# EasyEDA Pro project triple-J UAV 原理图+PCB.epro, schematic 飞控板_1

## Sheets
1 MCU: Assembly Variant: Basic; Board Name: Board1; Create Date: 2026-07-12; Page Name: P1; Project Name: stm32无人机; Schematic Name: Schematic1; Update Date: 2026-07-12; Company: 嘉立创EDA; Page Size: A4; Version: V1.0
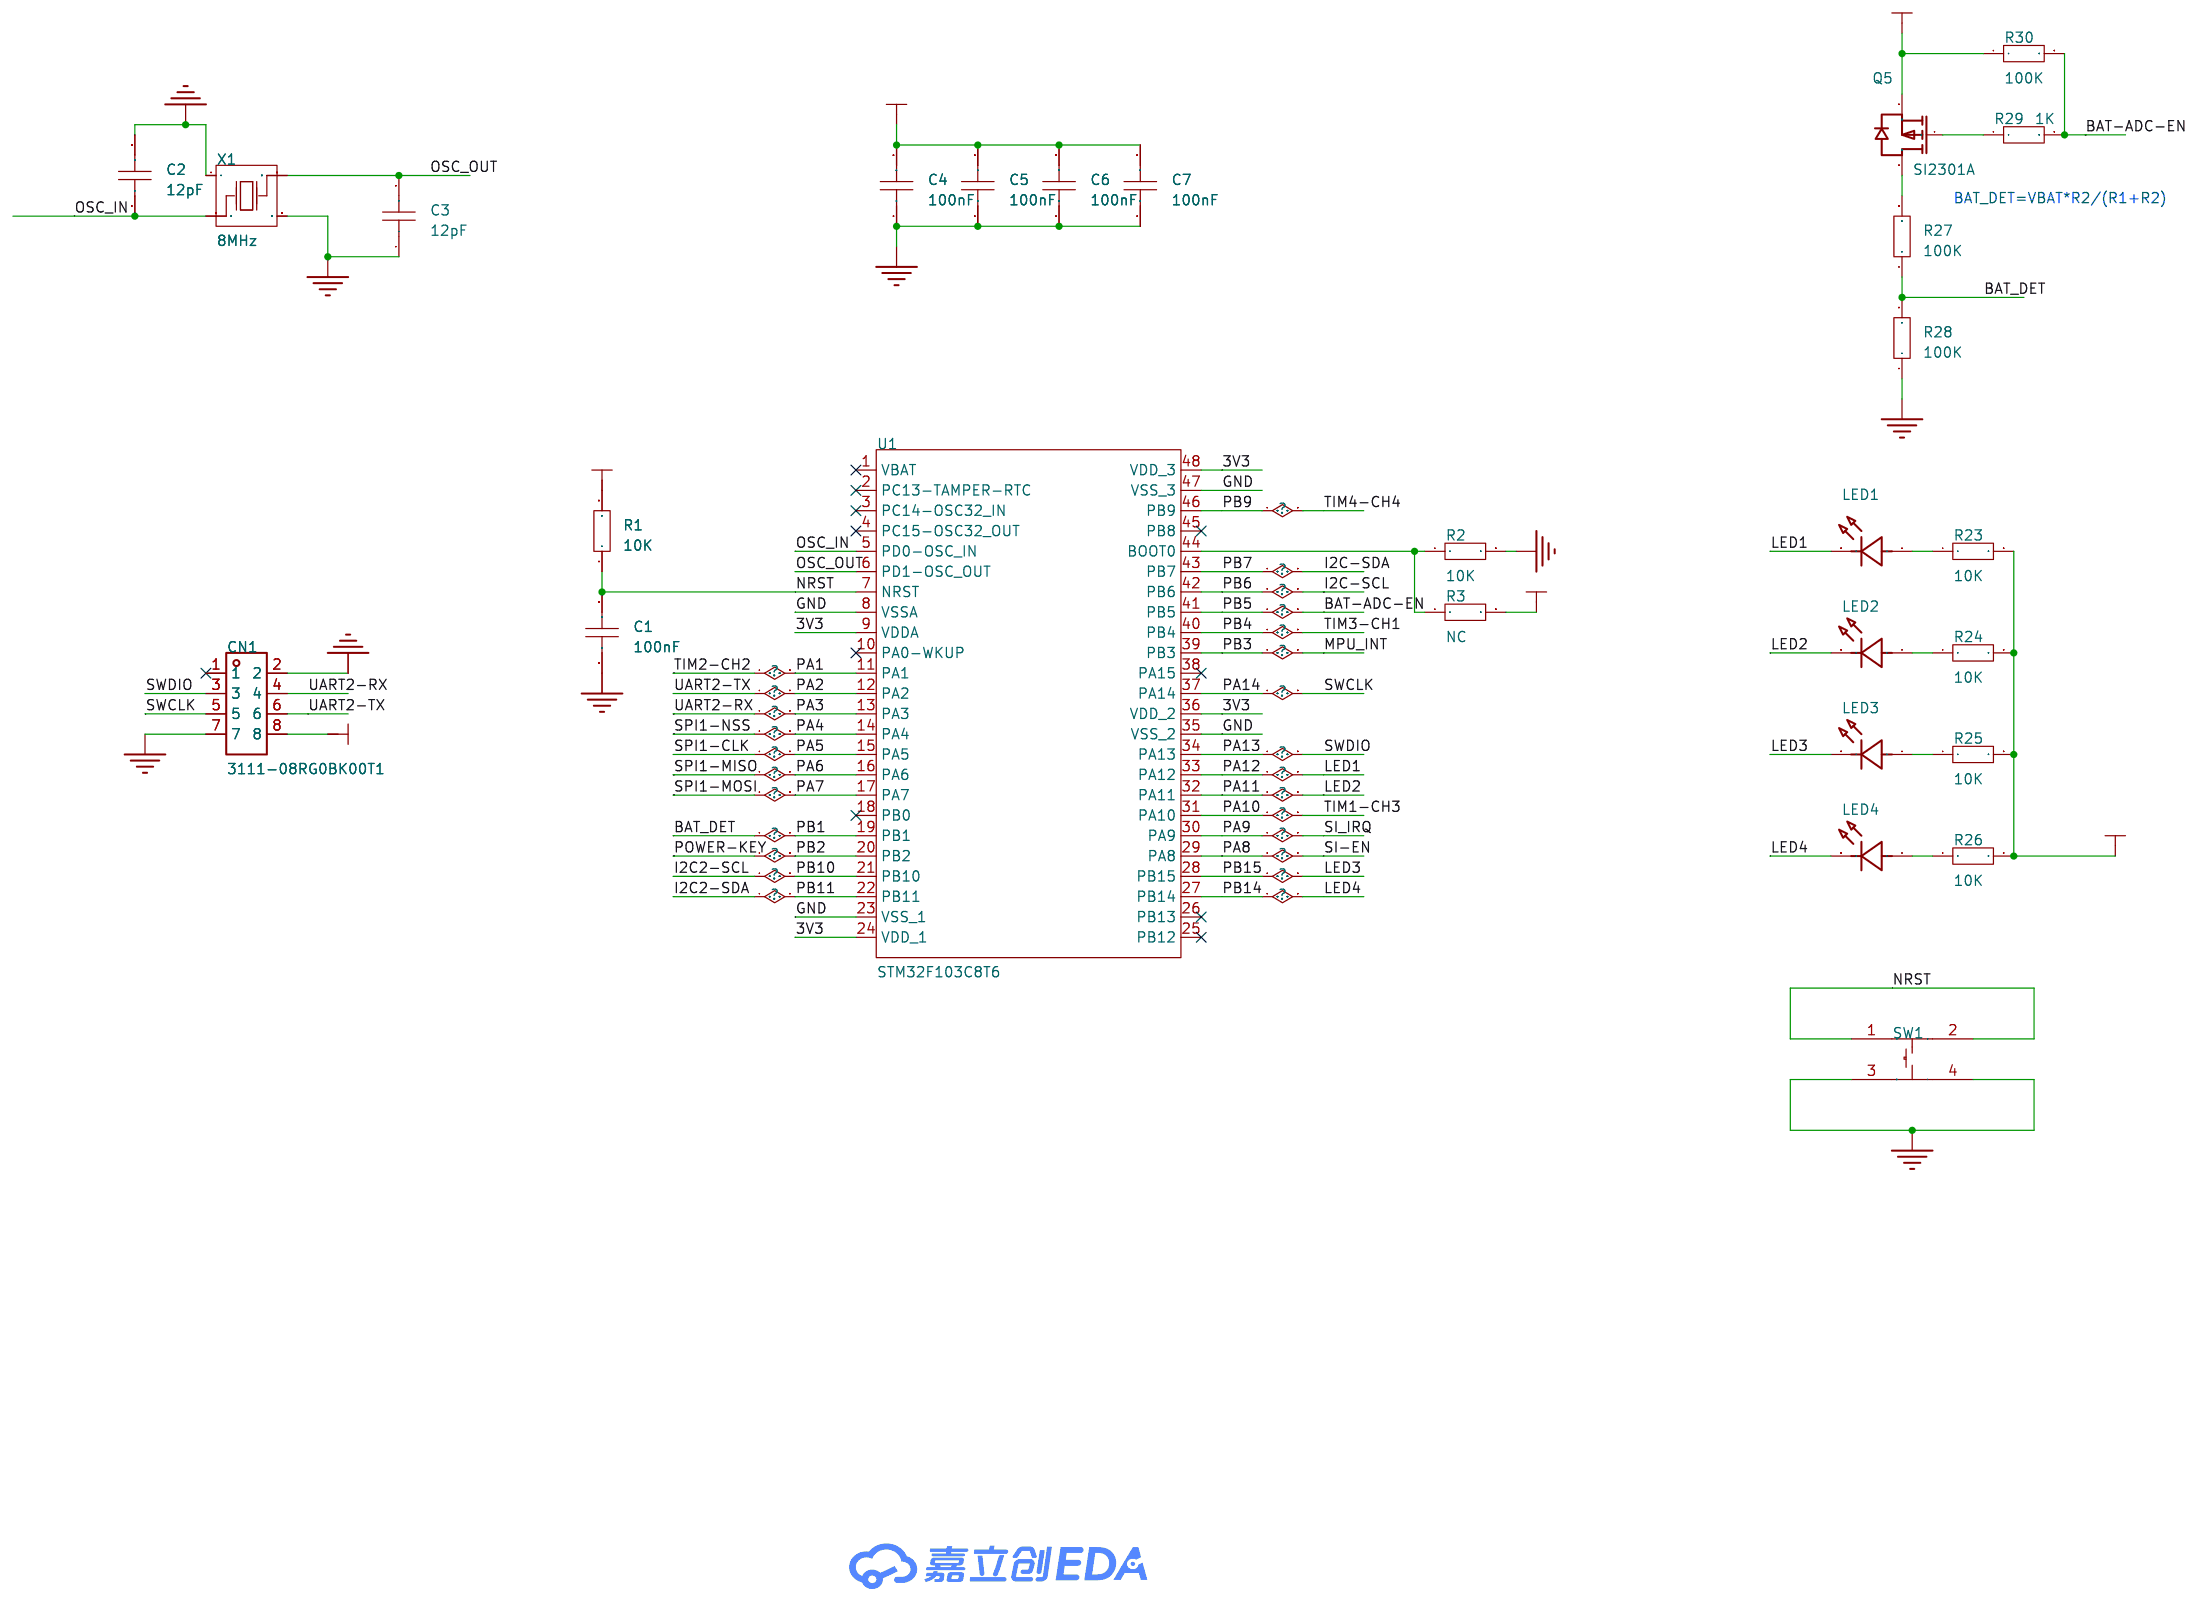
[diagram p5: MCU]
2 MPU
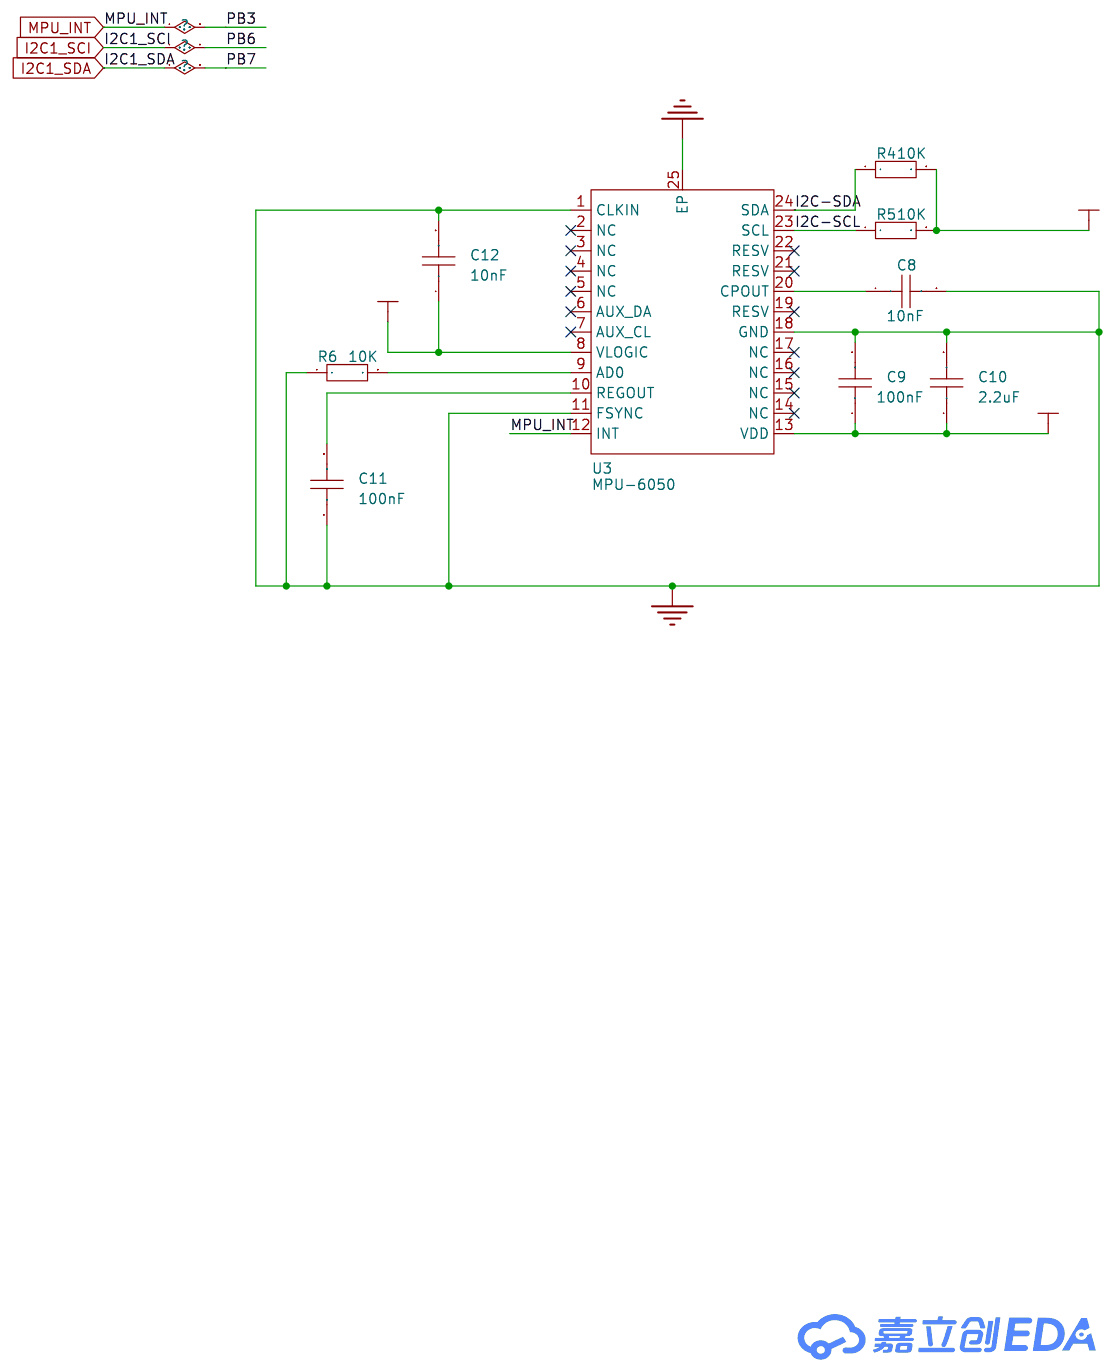
[diagram p6: MPU]
3 SI24R1
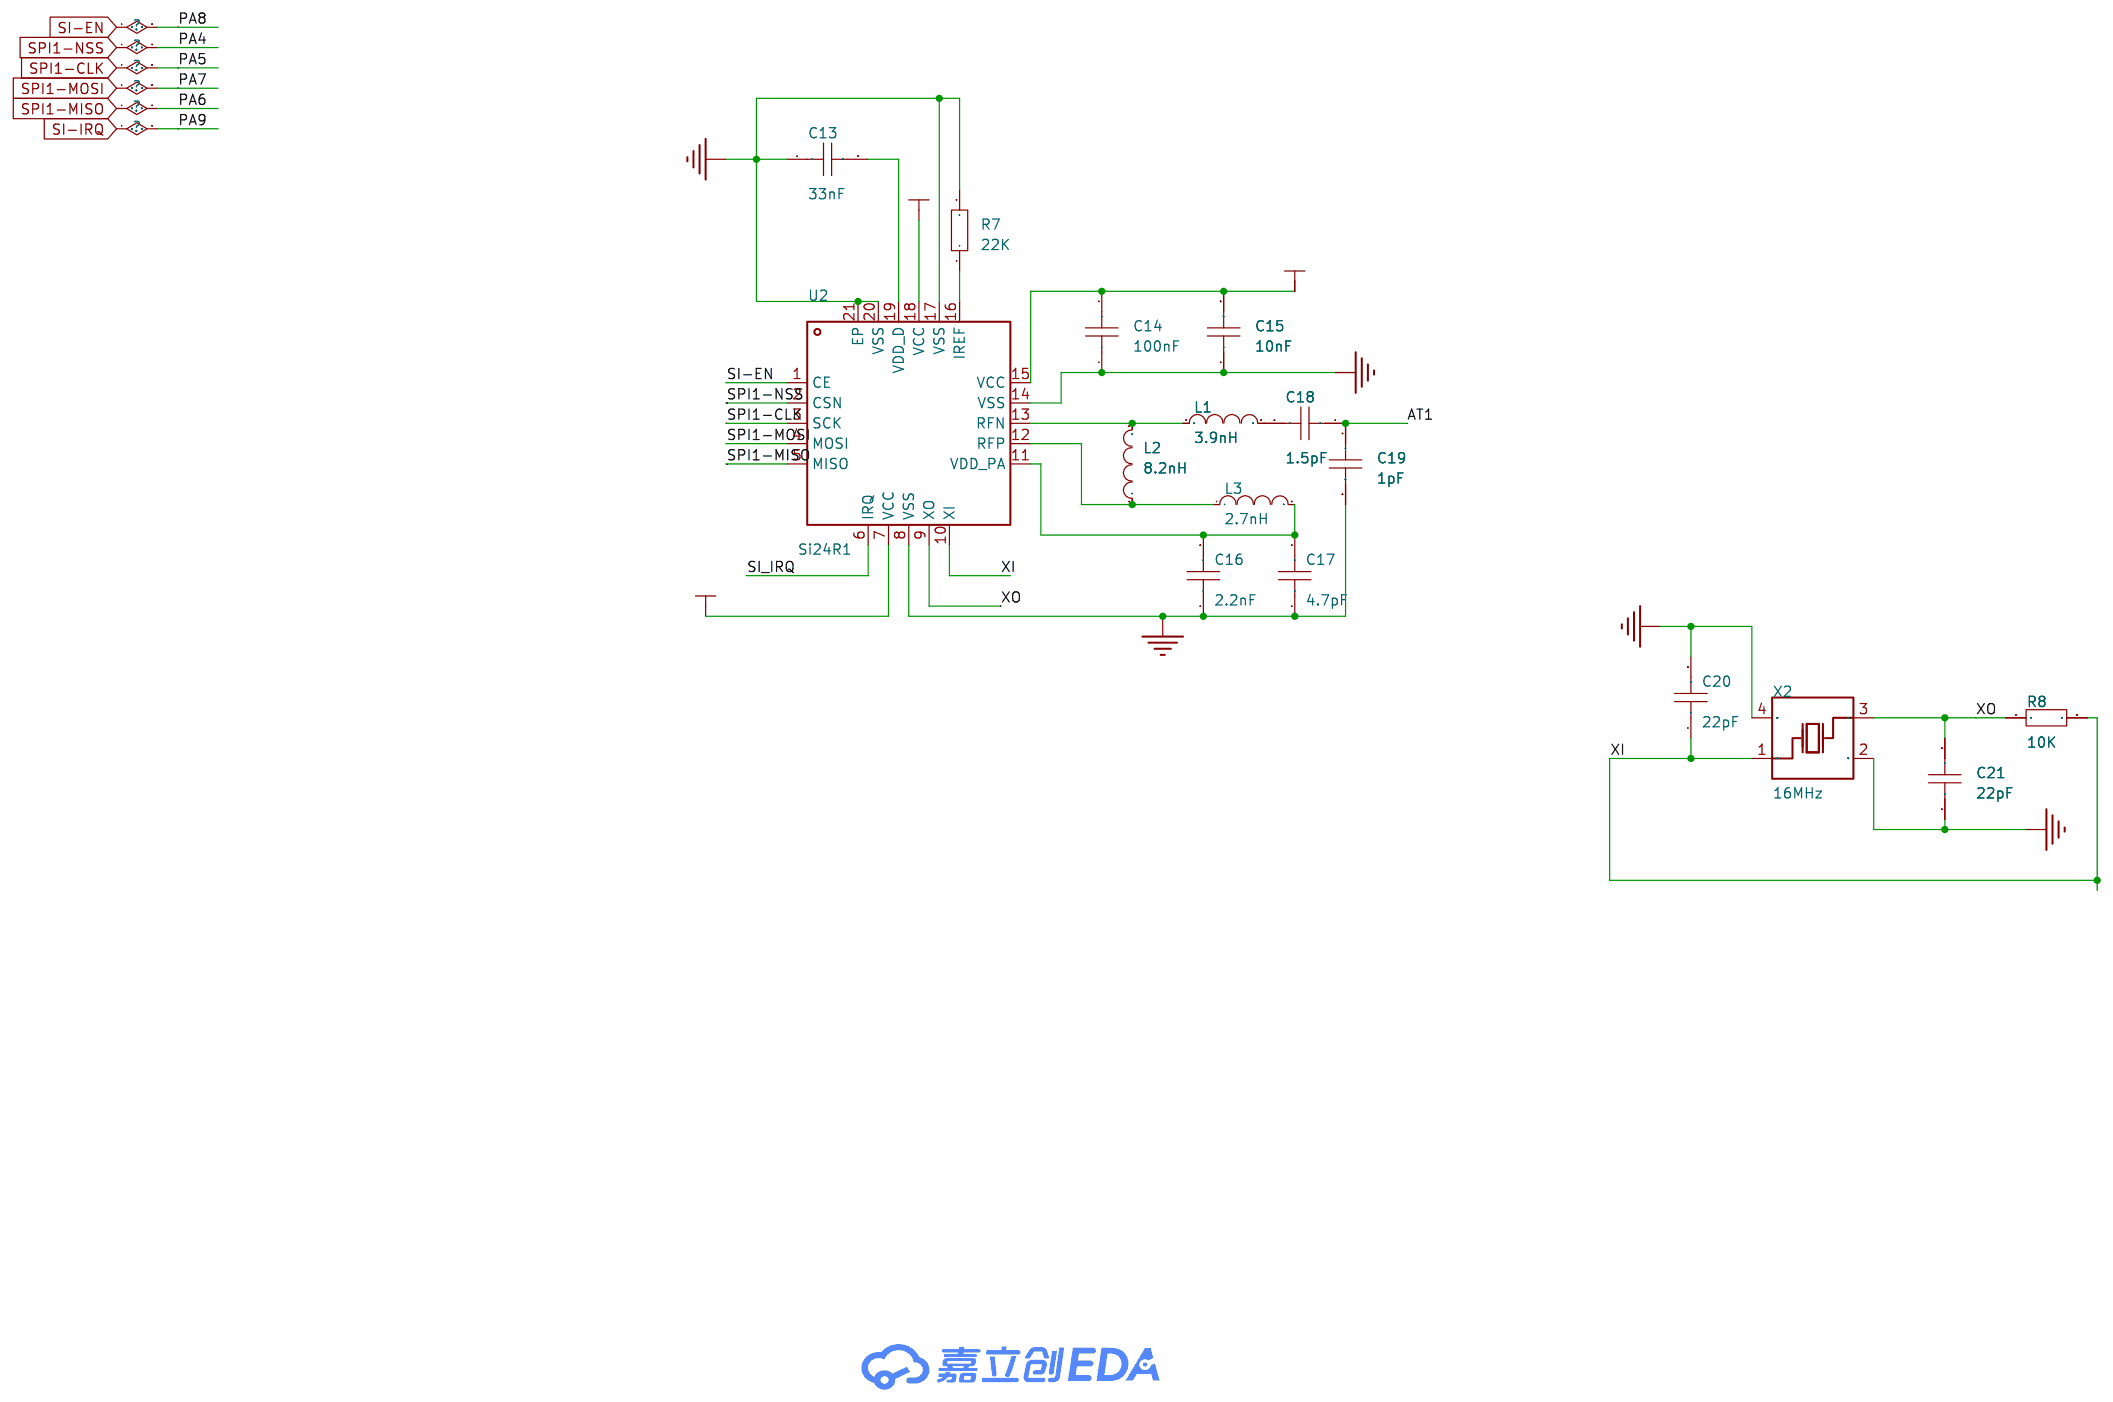
[diagram p7: SI24R1]
4 激光测高VL53
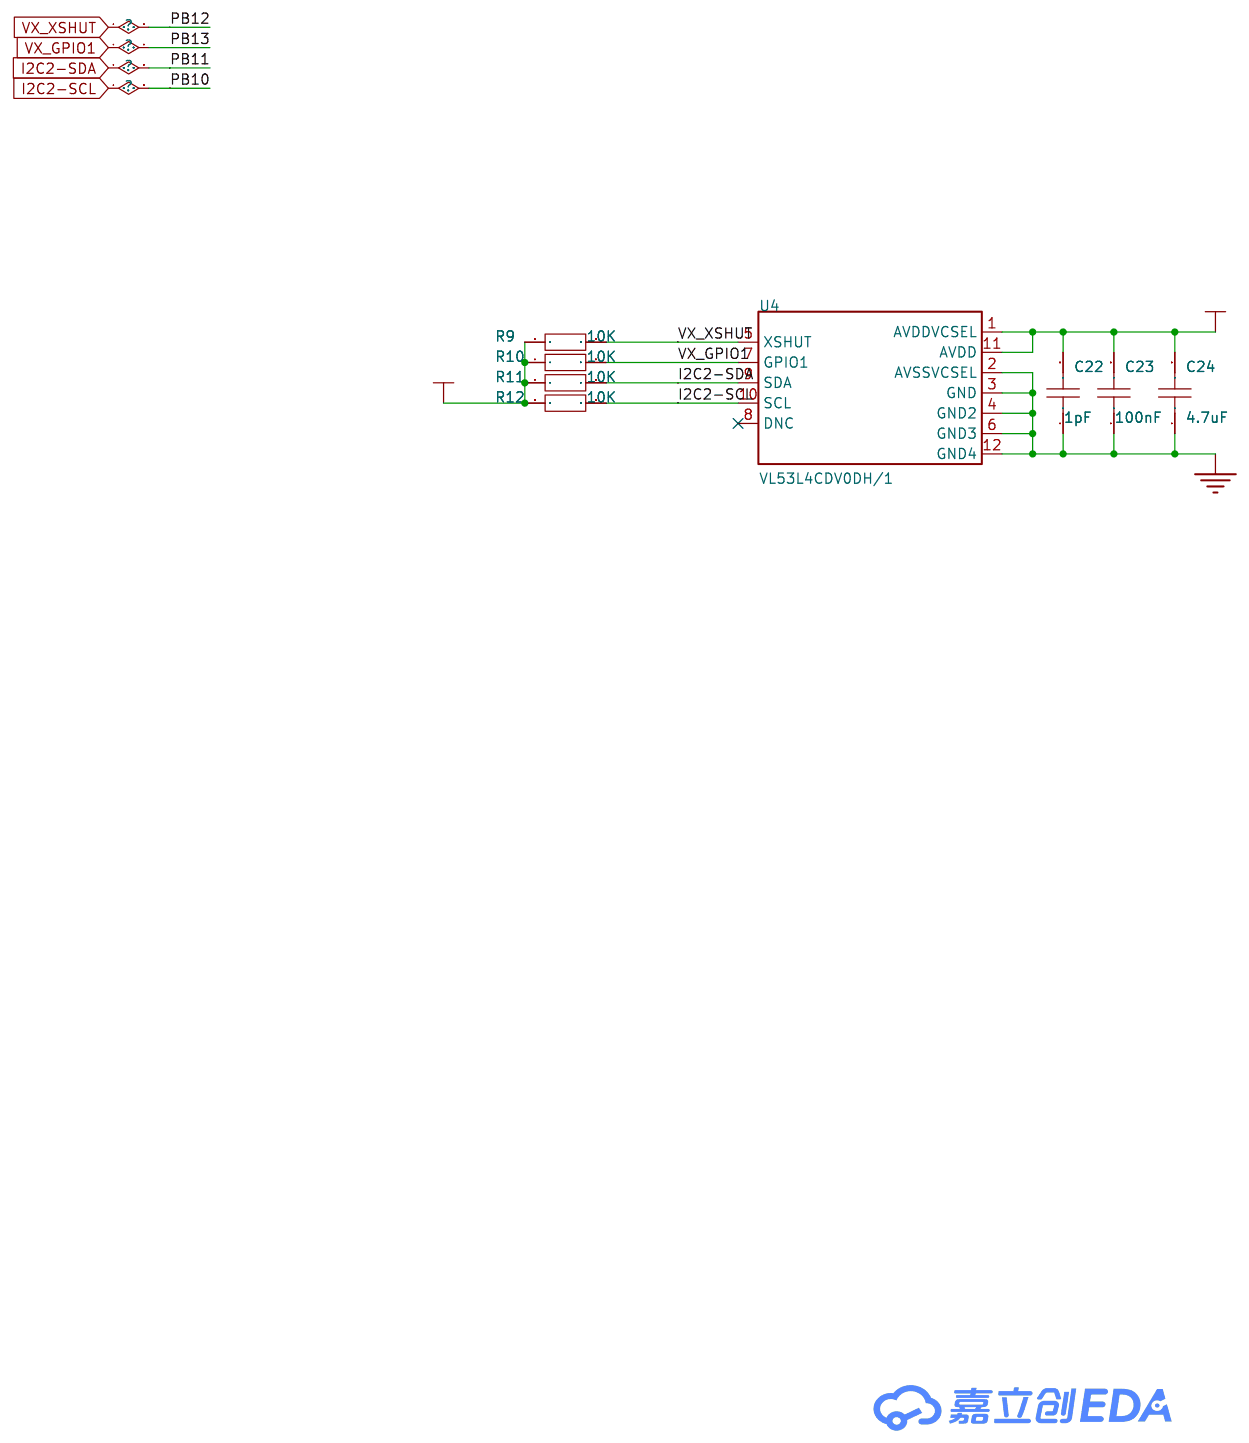
[diagram p8: 激光测高VL53]
5 电源管理
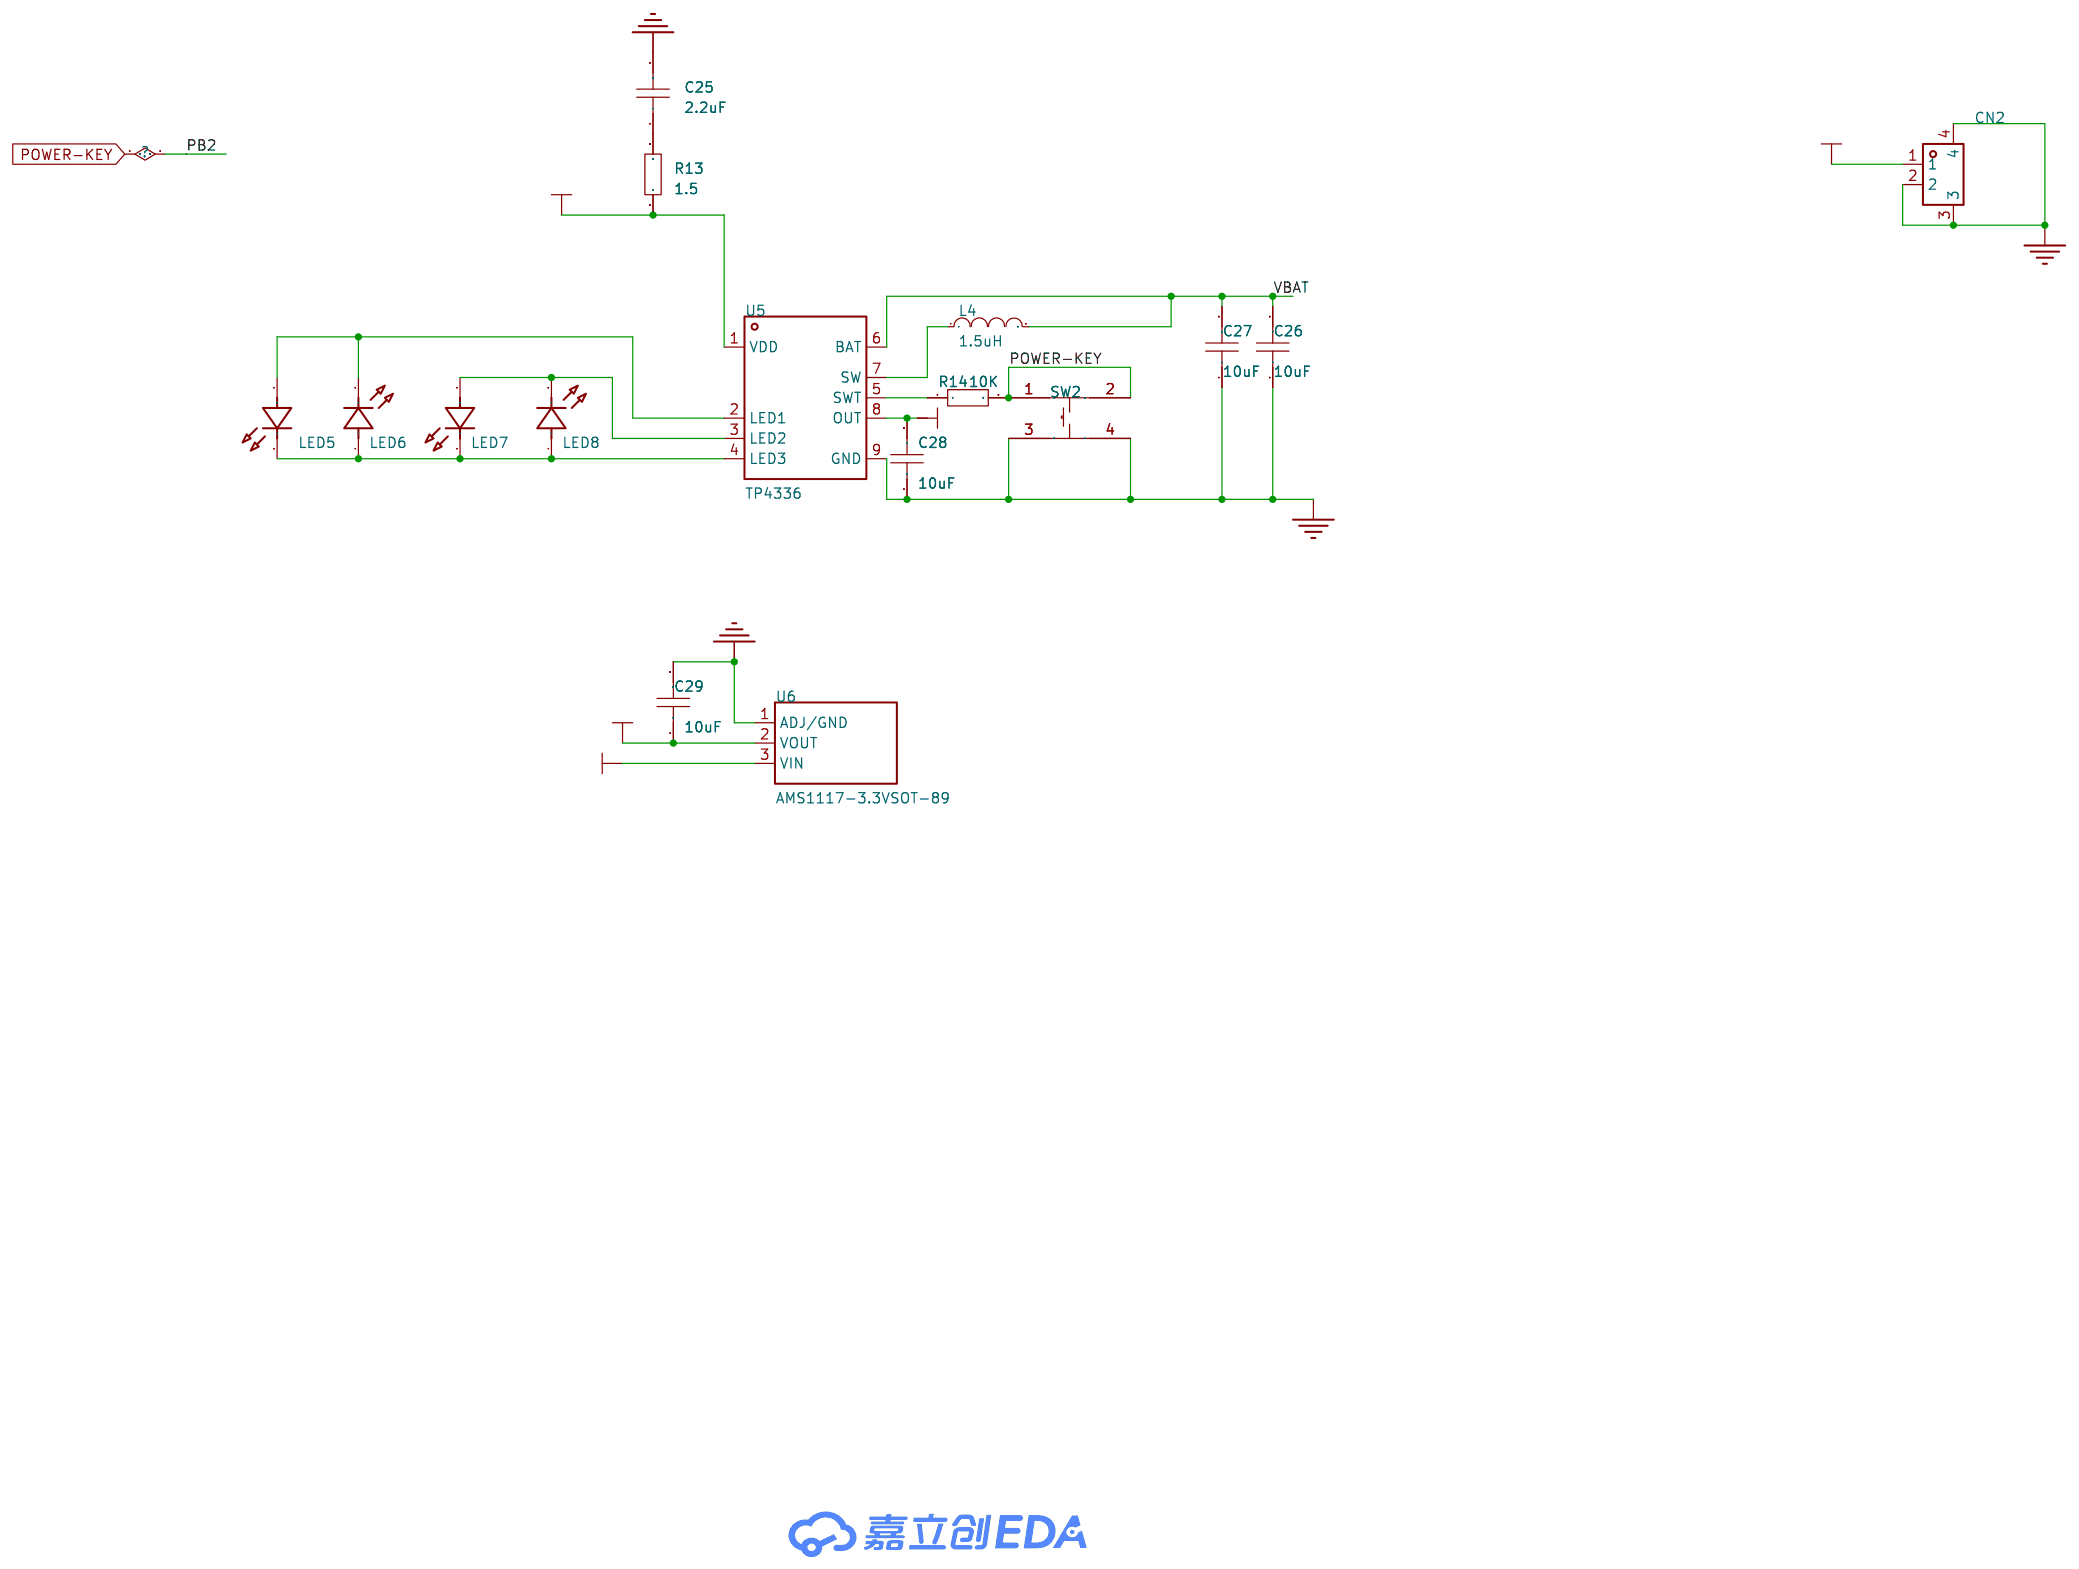
[diagram p9: 电源管理]
6 电机驱动
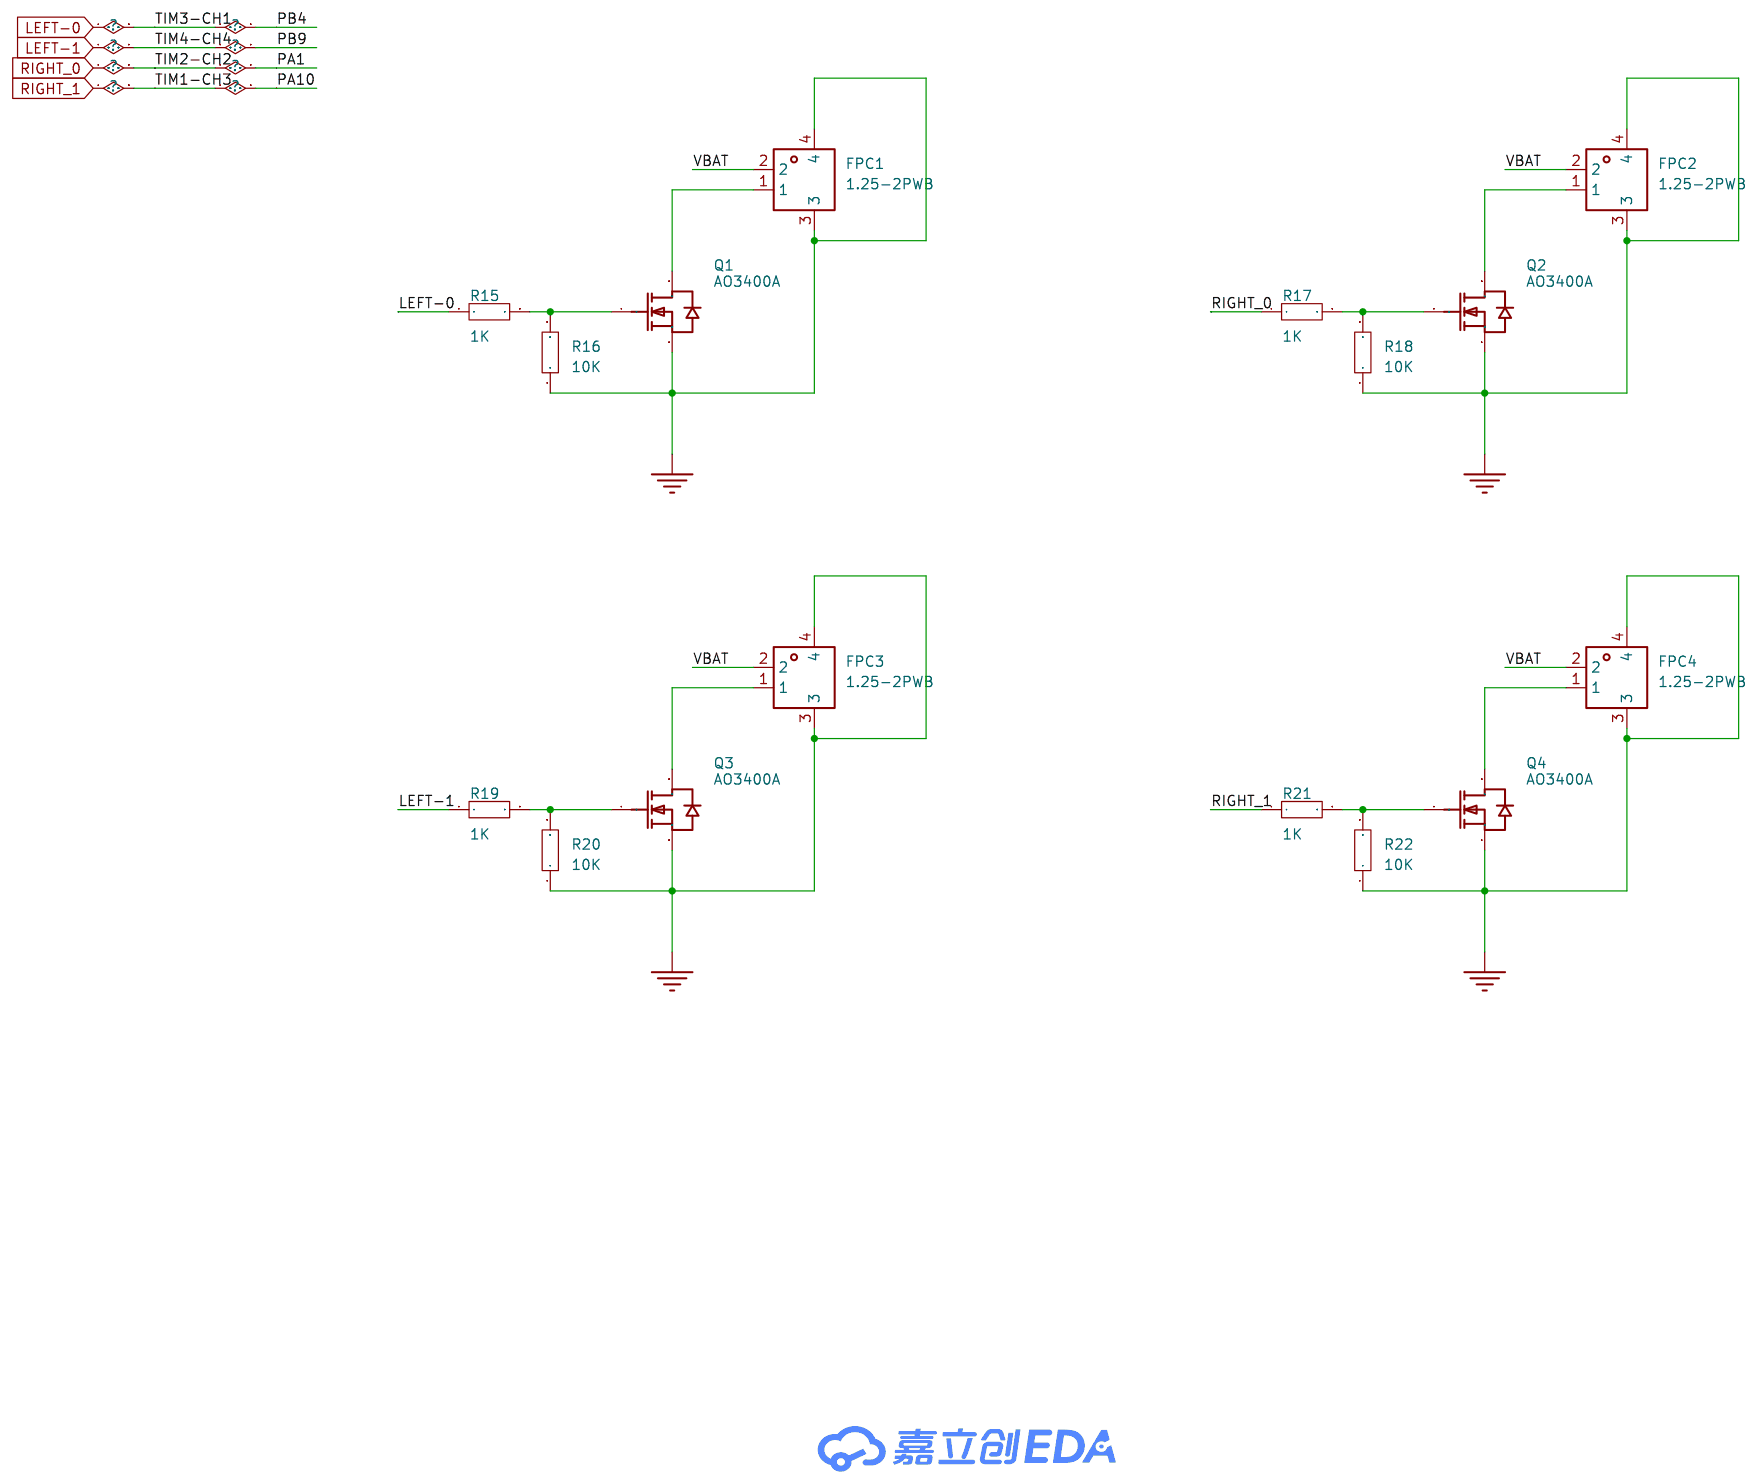
[diagram p10: 电机驱动]

## Parts
sheet MCU
C1  100nF  [C0603]
C2  12pF  [C0603]
C3  12pF  [C0603]
C4  100nF  [C0603]
C5  100nF  [C0603]
C6  100nF  [C0603]
C7  100nF  [C0603]
CN1  3111-08RG0BK00T1  [CONN-TH_3111-08RG0BK00T1]
LED1  XL-1005UYC  [LED0402-FD_YELLOW]
LED2  XL-1005UYC  [LED0402-FD_YELLOW]
LED3  XL-1005UYC  [LED0402-FD_YELLOW]
LED4  XL-1005UYC  [LED0402-FD_YELLOW]
Q5  SI2301A  [SOT-23-3_L2.9-W1.3-P1.90-LS2.4-BR]
R1  10K  [R0603]
R2  10K  [R0603]
R3  NC  [R0603]
R23  10K  [R0603]
R24  10K  [R0603]
R25  10K  [R0603]
R26  10K  [R0603]
R27  100K  [R0603]
R28  100K  [R0603]
R29  1K  [R0603]
R30  100K  [R0603]
SW1  SKRPACE010  [KEY-SMD_4P-L4.2-W3.2-P2.20-LS4.6]
U1  STM32F103C8T6  [LQFP-48_L7.0-W7.0-P0.50-LS9.0-BL]
X1  8MHz  [CRYSTAL-SMD_4P-L3.2-W2.5-BL]
sheet MPU
C8  10nF  [C0603]
C9  100nF  [C0603]
C10  2.2uF  [C0603]
C11  100nF  [C0603]
C12  10nF  [C0603]
R4  10K  [R0603]
R5  10K  [R0603]
R6  10K  [R0603]
U3  MPU-6050  [QFN-24_L4.0-W4.0-P0.50-BL-EP2.7]
sheet SI24R1
C13  33nF  [C0603]
C14  100nF  [C0603]
C15  10nF  [C0603]
C16  2.2nF  [C0603]
C17  4.7pF  [C0603]
C18  1.5pF  [C0603]
C19  1pF  [C0603]
C20  22pF  [C0603]
C21  22pF  [C0603]
L1  3.9nH  [L0603]
L2  8.2nH  [L0603]
L3  2.7nH  [L0603]
R7  22K  [R0603]
R8  10K  [R0603]
U2  Si24R1  [QFN-20_L4.0-W4.0-P0.50-BL-EP]
X2  16MHz  [CRYSTAL-SMD_4P-L2.5-W2.0-BL-2]
sheet 激光测高VL53
C22  1pF  [C0603]
C23  100nF  [C0603]
C24  4.7uF  [C0603]
R9  10K  [R0603]
R10  10K  [R0603]
R11  10K  [R0603]
R12  10K  [R0603]
U4  VL53L4CDV0DH/1  [LGA-12_L4.4-W2.4_VL53L0X]
sheet 电机驱动
FPC1  1.25-2PWB  [CONN-SMD_2P-P1.25_DEALON_1.25-2PWB]
FPC2  1.25-2PWB  [CONN-SMD_2P-P1.25_DEALON_1.25-2PWB]
FPC3  1.25-2PWB  [CONN-SMD_2P-P1.25_DEALON_1.25-2PWB]
FPC4  1.25-2PWB  [CONN-SMD_2P-P1.25_DEALON_1.25-2PWB]
Q1  AO3400A  [SOT-23-3_L2.9-W1.3-P1.90-LS2.4-BR]
Q2  AO3400A  [SOT-23-3_L2.9-W1.3-P1.90-LS2.4-BR]
Q3  AO3400A  [SOT-23-3_L2.9-W1.3-P1.90-LS2.4-BR]
Q4  AO3400A  [SOT-23-3_L2.9-W1.3-P1.90-LS2.4-BR]
R15  1K  [R0603]
R16  10K  [R0603]
R17  1K  [R0603]
R18  10K  [R0603]
R19  1K  [R0603]
R20  10K  [R0603]
R21  1K  [R0603]
R22  10K  [R0603]
sheet 电源管理
C25  2.2uF  [C0603]
C26  10uF  [C0603]
C27  10uF  [C0603]
C28  10uF  [C0603]
C29  10uF  [C0603]
CN2  ZX-XH2.54-2PWT  [CONN-SMD_2P-P2.54_MEGASTAR_ZX-XH2.54-2PWT]
L4  1.5uH  [L0603]
LED5  XL-1005UYC  [LED0402-FD_YELLOW]
LED6  XL-1005UYC  [LED0402-FD_YELLOW]
LED7  XL-1005UYC  [LED0402-FD_YELLOW]
LED8  XL-1005UYC  [LED0402-FD_YELLOW]
R13  1.5  [R0603]
R14  10K  [R0603]
SW2  SKRPACE010  [KEY-SMD_4P-L4.2-W3.2-P2.20-LS4.6]
U5  TP4336  [ESOP-8_L4.9-W3.9-P1.27-LS6.0-BL-EP-1]
U6  AMS1117-3.3VSOT-89  [SOT-89-3_L4.5-W2.5-P1.50-LS4.2-BR]

## Library data of the parts
C1-C29 = CAP_0603: Supplier Footprint: 0603
CN1 = 3111-08RG0BK00T1: LCSC Part Name: 2mm 2x4P 排数:2 每排P数:4; Supplier Part: C720751; Manufacturer: Wcon(维峰电子); Supplier Footprint: 弯插,P=2mm; JLCPCB Part Class: Extended Part; Datasheet: https://atta.szlcsc.com/upload/public/pdf/source/20200908/C720751_429ECEF3D5B5C4289EC4F86089830CA0.pdf; Supplier: LCSC; Connector Type: 简牛座; Pitch: 2mm; Structure: 2x4P; Holder Type: 弯插; Row Spacing: 2mm; Number of Rows: 2; Pin Number in each Row: 4; Contact Material: 黄铜; Contact Plating: 金
LED1-LED4 = XL-1005UYC: LCSC Part Name: 停产 0402黄光贴片式发光二极管; Supplier Part: C965792; Manufacturer: XINGLIGHT(成兴光); Supplier Footprint: 0402; JLCPCB Part Class: Extended Part; Datasheet: https://item.szlcsc.com/datasheet/XL-1005UYC/1051401.html; Supplier: LCSC; Illumination Color: 黄色; Voltage - Forward(Vf): 2.3V; Power(Watts): 50mW; Forward Current: 20mA; Wavelength - Dominant: 585nm~595nm; Peak Wavelength: 590nm; Diode Configuration: 独立二极管; Lens Color: 无色透明透镜; Luminous Intensity: 830mcd; Viewing Angle: 120°; Mounting Style: 正贴; Operating Temperature: -20℃~+85℃
Q5 = SI2301A: LCSC Part Name: 1个P沟道 耐压:20V 电流:2.8A; Supplier Part: C347482; Manufacturer: UMW(友台半导体); Supplier Footprint: SOT-23; JLCPCB Part Class: Extended Part; Datasheet: https://item.szlcsc.com/datasheet/SI2301A/324142.html; Supplier: LCSC; Number: 1个P沟道; Drain to Source Voltage: 20V; Current - Continuous Drain(Id): 2.8A; RDS(on): 90mΩ@4.5V；110mΩ@2.5V; Pd - Power Dissipation: 400mW; Gate Threshold Voltage (Vgs(th)): 1V@250uA; Gate Charge(Qg): 5.5nC@4.5V；3.3nC@2.5V; Input Capacitance(Ciss): 405pF; Reverse Transfer Capacitance (Crss@Vds): 55pF; Operating Temperature: -55℃~+150℃; Type: P沟道; Output Capacitance(Coss): 75pF
R1-R30 = Res_0603: Supplier Footprint: 0603
SW1 SW2 = SKRPACE010: LCSC Part Name: 4.2*3.2*2.5mm 立贴 轻触开关; Supplier Part: C139797; Manufacturer: ALPSALPINE(阿尔卑斯阿尔派); Supplier Footprint: SMD-4P,4.2x3.2mm; JLCPCB Part Class: Extended Part; Datasheet: https://item.szlcsc.com/datasheet/SKRPACE010/151122.html; Supplier: LCSC; Circuit: 单刀单掷; Actuator Style: 椭圆形按钮; Mounting Type: 立贴; Length: 4.2mm; Width: 3.2mm; Switch Height: 2.5mm; Contact Current: 50mA; Voltage Rating: 16V
U1 = STM32F103C8T6: LCSC Part Name: 主流增强型ARM Cortex-M3 MCU，具有64 KB Flash、72 MHz CPU、电机控制、USB和CAN; Supplier Part: C8734; Manufacturer: ST(意法半导体); Supplier Footprint: LQFP-48(7x7); JLCPCB Part Class: Extended Part; Datasheet: https://item.szlcsc.com/datasheet/STM32F103C8T6/9243.html; Supplier: LCSC; CPU Core: ARM-M3; CPU Maximum Speed: 72MHz; Program Storage Size: 64KB; Program Memory Type: FLASH; Number of I/O: 37; ADC (Bit): 12bit; Voltage - Supply: 2V~3.6V
X1 = TAXM8M4RDBCCT2T: LCSC Part Name: 8MHz ±10ppm 10pF; Supplier Part: C400090; Manufacturer: YJX(雅晶鑫); Supplier Footprint: SMD3225-4P; JLCPCB Part Class: Extended Part; Datasheet: https://item.szlcsc.com/datasheet/TAXM8M4RDBCCT2T/383475.html; Supplier: LCSC; Type: 贴片晶振; Normal temperature Frequency Tolerance: ±10ppm; Load Capacitance: 10pF; Frequency Stability: ±15ppm; Equivalent Series Resistance(ESR): 250Ω; Operating Temperature: -40℃~+85℃
U3 = MPU-6050: Supplier Part: C24112; Manufacturer: TDK InvenSense(应美盛); Supplier Footprint: QFN-24-EP(4x4); JLCPCB Part Class: Extended Part; Datasheet: https://item.szlcsc.com/datasheet/MPU-6050/24852.html; Supplier: LCSC; Accelerometer Sensing Axis: X,Y,Z; Acceleration Measurement Range (MAX): ±16g; Gyroscope Sensing Axis: X,Y,Z; Gyroscope Measurement Range (MAX): ±2000dps; Sensor Type: IMU(加速度计+陀螺仪); Output Bits: 16bit; Interface: I2C; Voltage - Supply: 2.375V~3.46V; Cache Size: 1KB; Standby Current: 5uA; Operating Temperature: -40℃~+85℃; Features: 运动事件检测；同步与时间戳
L1-L4 = L_0603
U2 = Si24R1: LCSC Part Name: 超低功耗、高性能2.4 GHz GFSK收发器; Supplier Part: C14436; Manufacturer: 南京中科微; Supplier Footprint: QFN-20-EP(4x4); JLCPCB Part Class: Extended Part; Datasheet: https://item.szlcsc.com/datasheet/Si24R1/15098.html; Supplier: LCSC; Frequency Range: 2.4GHz~2.525GHz; Interface: SPI; Voltage - Supply: 1.9V~3.6V; Applications: ISM; Output Power: 7dBm; Data Rate: 2Mbps; Current Of Transmitting: 12mA; Sensitivity: -96dBm; Receive Current: 15mA; Typical Application Frequency: 2.4GHz; Operating Temperature: -40℃~+85℃; Type: 收发器
X2 = SX25Y016000B91T: LCSC Part Name: 2520 16M 9PF  10ppm  -20 -75℃; Supplier Part: C271644; Manufacturer: TKD(泰晶); Supplier Footprint: SMD2520-4P; JLCPCB Part Class: Extended Part; Datasheet: https://item.szlcsc.com/datasheet/SX25Y016000B91T/260707.html; Supplier: LCSC; Type: 贴片晶振; Normal temperature Frequency Tolerance: ±10ppm; Load Capacitance: 9pF; Frequency Stability: ±10ppm; Equivalent Series Resistance(ESR): 80Ω
U4 = VL53L4CDV0DH/1: LCSC Part Name: I2C接口的飞行时间高精度接近传感器; Supplier Part: C3178291; Manufacturer: ST(意法半导体); Supplier Footprint: SMD-12P; JLCPCB Part Class: Extended Part; Datasheet: https://item.szlcsc.com/datasheet/VL53L4CDV0DH%252F1/3740229.html; Supplier: LCSC; Interface: I2C; Voltage - Supply: 2.6V~3.5V; Linear Range: 0cm~130cm; Current - Supply: 24mA; Length: 4.4mm; Width: 2.4mm; Height: 1mm; Operating Temperature: -30℃~+85℃; Features: 温度补偿
FPC1-FPC4 = 1.25-2PWB: LCSC Part Name: 1x2P 间距:1.25mm 卧贴 系列:PicoBlade(MX 1.25); Supplier Part: C2905009; Manufacturer: DEALON(德艺隆); Supplier Footprint: SMD,P=1.25mm,卧贴; JLCPCB Part Class: Extended Part; Datasheet: https://item.szlcsc.com/datasheet/1.25-2PWB/3172294.html; Supplier: LCSC; Pins Structure: 1x2P; Pitch: 1.25mm; Mounting Type: 卧贴; Reference Series: PicoBlade(MX 1.25); Number of Pins: 2P; Number of Rows: 1; Number of PINs Per Row: 2; Current Rating: 1A; Contact Material: 黄铜; Contact Plating: 锡; Operating Temperature: -25℃~+85℃; Voltage Rating: 125V; Plastic Material: LCP; Flame Retardant Rating: UL94V-0; Supplementary Features: 辅助焊脚; Color: 米色
Q1-Q4 = AO3400A_C20917: LCSC Part Name: 1个N沟道 耐压:30V 电流:5.7A; Supplier Part: C20917; Manufacturer: AOS; Supplier Footprint: SOT-23-3L; JLCPCB Part Class: Basic Part; Datasheet: https://item.szlcsc.com/datasheet/AO3400A/21629.html; Supplier: LCSC; Drain to Source Voltage: 30V; RDS(on): 48mΩ@2.5V; Gate Threshold Voltage (Vgs(th)): 1.45V@250uA; Gate Charge(Qg): 7nC@10V; Input Capacitance(Ciss): 630pF@15V; Operating Temperature: -55℃~+150℃@(Tj); Type: N沟道
CN2 = ZX-XH2.54-2PWT: LCSC Part Name: 1x2P 间距:2.5mm 卧贴 系列:XH; Supplier Part: C7429671; Manufacturer: Megastar(兆星); Supplier Footprint: SMD,P=2.5mm,卧贴; JLCPCB Part Class: Extended Part; Datasheet: https://item.szlcsc.com/datasheet/ZX-XH2.54-2PWT/8427588.html; Supplier: LCSC; Pins Structure: 1x2P; Pitch: 2.5mm; Mounting Type: 卧贴; Reference Series: XH; Number of Pins: 2P; Number of Rows: 1; Number of PINs Per Row: 2; Current Rating: 3A; Contact Material: 黄铜; Contact Plating: 锡; Operating Temperature: -25℃~+85℃; Voltage Rating: 250V; Plastic Material: LCP; Supplementary Features: 辅助焊脚; Color: 米色; Z-Height of the Board: 6.2mm; X-Length of Bottom Edge on Board (Spacing Line): 10mm; Y-Width of Bottom Edge on Board: 7.8mm
LED5-LED8 = XL-1005UYC_C25503856: LCSC Part Name: 0402黄光贴片式发光二极管; Supplier Part: C25503856; Manufacturer: XINGLIGHT(成兴光); Supplier Footprint: 0402; JLCPCB Part Class: Extended Part; Datasheet: https://item.szlcsc.com/datasheet/XL-1005UYC/27234970.html; Supplier: LCSC; Lamp Holder Type: 1.0mmx0.5mm方形灯头; Illumination Color: 黄色; Voltage - Forward(Vf): 2.4V; Power(Watts): 50mW; Forward Current: 20mA; Wavelength - Dominant: 585nm~595nm; Peak Wavelength: 590nm; Diode Configuration: 独立二极管; Lens Color: 无色透明透镜; Luminous Intensity: 210mcd; Viewing Angle: 120°; Operating Temperature: -40℃~+85℃
U5 = TP4336: LCSC Part Name: 单通道1-Wire主控制器; Supplier Part: C29075510; Manufacturer: TPOWER(天源); Supplier Footprint: ESOP-8L; JLCPCB Part Class: Extended Part; Datasheet: https://item.szlcsc.com/datasheet/TP4336/30801980.html; Supplier: LCSC
U6 = AMS1117-3.3VSOT-89: Supplier Part: C9900008082; Supplier Footprint: SOT-89-3; JLCPCB Part Class: Extended Part; Supplier: LCSC

## Nets
3V3: C4.2 C5.2 C6.2 C7.2 C9.1 C10.1 C12.1 C14.2 C15.2 C22.2 C23.2 C24.2 C29.1 R1.2 R3.2 R4.2 R5.2 R9.1 R10.1 R11.1 R12.1 R23.2 R24.2 R25.2 R26.2 U1.9(VDDA) U1.24(VDD_1) U1.36(VDD_2) U1.48(VDD_3) U2.7(VCC) U2.15(VCC) U2.18(VCC) U3.8(VLOGIC) U3.13(VDD) U4.1(AVDDVCSEL) U4.11(AVDD) U6.2(VOUT)
+5V: C28.2 U5.8(OUT) U6.3(VIN)
GND: C1.1 C2.2 C3.1 C4.1 C5.1 C6.1 C7.1 C8.2 C9.2 C10.2 C11.1 C12.2 C13.1 C14.1 C15.1 C16.1 C17.1 C19.2 C20.2 C21.1 C22.1 C23.1 C24.1 C25.2 C26.1 C27.1 C28.1 C29.2 CN1.2 CN1.7 CN2.2 CN2.3 CN2.4 FPC1.3 FPC1.4 FPC2.3 FPC2.4 FPC3.3 FPC3.4 FPC4.3 FPC4.4 Q1.2(S) Q2.2(S) Q3.2(S) Q4.2(S) R2.2 R6.1 R7.2 R16.1 R18.1 R20.1 R22.1 R28.1 SW1.3 SW1.4 SW2.3 SW2.4 U1.8(VSSA) U1.23(VSS_1) U1.35(VSS_2) U1.47(VSS_3) U2.8(VSS) U2.14(VSS) U2.17(VSS) U2.20(VSS) U2.21(EP) U3.1(CLKIN) U3.11(FSYNC) U3.18(GND) U3.25(EP) U4.2(AVSSVCSEL) U4.3(GND) U4.4(GND2) U4.6(GND3) U4.12(GND4) U5.9(GND) U6.1(ADJ/GND) X1.2 X1.4 X2.2(GND) X2.4(GND)
VBAT: C26.2 C27.2 CN2.1 FPC1.2 FPC2.2 FPC3.2 FPC4.2 L4.2 Q5.2(S) R30.1 U5.6(BAT)
VCC: CN1.8 R13.1 U5.1(VDD)
AT1: C18.1 C19.1
BAT-ADC-EN: R29.2 R30.2 U1.41(PB5)
BAT_DET: R27.1 R28.2 U1.19(PB1)
I2C2-SCL: R12.2 U1.21(PB10) U4.10(SCL)
I2C2-SDA: R11.2 U1.22(PB11) U4.9(SDA)
I2C-SCL: R5.1 U1.42(PB6) U3.23(SCL)
I2C-SDA: R4.1 U1.43(PB7) U3.24(SDA)
LED1: LED1.2(K) U1.33(PA12)
LED2: LED2.2(K) U1.32(PA11)
LED3: LED3.2(K) U1.28(PB15)
LED4: LED4.2(K) U1.27(PB14)
LEFT-0: R15.1 U1.40(PB4)
LEFT-1: R19.1 U1.46(PB9)
MPU_INT: U1.39(PB3) U3.12(INT)
NRST: C1.2 R1.1 SW1.1 SW1.2 U1.7(NRST)
OSC_IN: C2.1 U1.5(PD0-OSC_IN) X1.1
OSC_OUT: C3.2 U1.6(PD1-OSC_OUT) X1.3
PA1: R17.1 U1.11(PA1)
PA2: CN1.6 U1.12(PA2)
PA3: CN1.4 U1.13(PA3)
PA4: U1.14(PA4) U2.2(CSN)
PA5: U1.15(PA5) U2.3(SCK)
PA6: U1.16(PA6) U2.5(MISO)
PA7: U1.17(PA7) U2.4(MOSI)
PA8: U1.29(PA8) U2.1(CE)
PA9: U1.30(PA9) U2.6(IRQ)
PA10: R21.1 U1.31(PA10)
PA13: CN1.3 U1.34(PA13)
PA14: CN1.5 U1.37(PA14)
PB2: R14.2 SW2.1 SW2.2 U1.20(PB2)
PB12: R9.2 U4.5(XSHUT)
PB13: R10.2 U4.7(GPIO1)
XI: C20.1 R8.2 U2.10(XI) X2.1(OSC1)
XO: C21.2 R8.1 U2.9(XO) X2.3(OSC2)
$1N71: LED4.1(A) R26.1
$1N72: LED3.1(A) R25.1
$1N73: LED1.1(A) R23.1
$1N74: LED2.1(A) R24.1
$1N90: Q5.3(D) R27.2
$1N91: Q5.1(G) R29.1
$2N4: C8.1 U3.20(CPOUT)
$2N8: C11.2 U3.10(REGOUT)
$2N10: R6.2 U3.9(AD0)
$3N1: R7.1 U2.16(IREF)
$3N4: C13.2 U2.19(VDD_D)
$3N16: C18.2 L1.2
$3N19: L1.1 L2.2 U2.13(RFN)
$3N20: L2.1 L3.1 U2.12(RFP)
$3N21: C16.2 C17.2 L3.2 U2.11(VDD_PA)
$5N1: LED5.1(A) LED6.2(K) U5.2(LED1)
$5N2: LED5.2(K) LED6.1(A) LED7.2(K) LED8.1(A) U5.4(LED3)
$5N3: LED7.1(A) LED8.2(K) U5.3(LED2)
$5N5: C25.1 R13.2
$5N10: L4.1 U5.7(SW)
$5N11: R14.1 U5.5(SWT)
$6N2: FPC1.1 Q1.3(D)
$6N7: Q1.1(G) R15.2 R16.2
$6N10: Q2.1(G) R17.2 R18.2
$6N12: FPC2.1 Q2.3(D)
$6N15: Q3.1(G) R19.2 R20.2
$6N17: FPC3.1 Q3.3(D)
$6N20: Q4.1(G) R21.2 R22.2
$6N22: FPC4.1 Q4.3(D)
Net-(R2-1): R2.1 R3.1 U1.44(BOOT0)

Not connected (* = marked no-connect by the designer): CN1 1*; U1 1(VBAT)* 2(PC13-TAMPER-RTC)* 3(PC14-OSC32_IN)* 4(PC15-OSC32_OUT)* 10(PA0-WKUP)* 18(PB0)* 25(PB12)* 26(PB13)* 38(PA15)* 45(PB8)*; U3 2(NC)* 3(NC)* 4(NC)* 5(NC)* 6(AUX_DA)* 7(AUX_CL)* 14(NC)* 15(NC)* 16(NC)* 17(NC)* 19(RESV)* 21(RESV)* 22(RESV)*; U4 8(DNC)*

## Notes on the sheets
sheet 1
- BAT_DET=VBAT*R2/(R1+R2)
